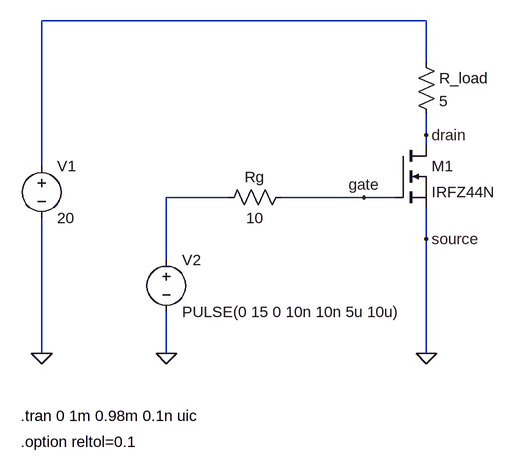
[diagram p0: schematic Switching MOSFET.asc]
Switching MOSFET.asc, the LTspice schematic file:
Version 4
SHEET 1 880 680
WIRE 544 -208 -48 -208
WIRE 544 -144 544 -208
WIRE 544 -32 544 -64
WIRE 544 -16 544 -32
WIRE -48 16 -48 -208
WIRE 240 64 144 64
WIRE 448 64 320 64
WIRE 496 64 448 64
WIRE 544 128 544 80
WIRE 144 160 144 64
WIRE -48 304 -48 96
WIRE 144 304 144 240
WIRE 544 304 544 128
FLAG 144 304 0
FLAG 544 304 0
FLAG -48 304 0
FLAG 544 -32 drain
FLAG 448 64 gate
FLAG 544 128 source
SYMBOL voltage 144 144 R0
WINDOW 123 0 0 Left 0
WINDOW 39 0 0 Left 0
SYMATTR InstName V2
SYMATTR Value PULSE(0 15 0 10n 10n 5u 10u)
SYMBOL res 336 48 R90
WINDOW 0 0 56 VBottom 2
WINDOW 3 32 56 VTop 2
SYMATTR InstName Rg
SYMATTR Value 10
SYMBOL nmos 496 -16 R0
SYMATTR InstName M1
SYMATTR Value IRFZ44N
SYMBOL voltage -48 0 R0
WINDOW 123 0 0 Left 0
WINDOW 39 0 0 Left 0
SYMATTR InstName V1
SYMATTR Value 20
SYMBOL res 528 -160 R0
SYMATTR InstName R_load
SYMATTR Value 5
TEXT -80 400 Left 2 !.tran 0 1m 0.98m 0.1n uic
TEXT -80 440 Left 2 !.option reltol=0.1

The netlist it stands for:
* Switching MOSFET.asc
V2 N002 0 PULSE(0 15 0 10n 10n 5u 10u)
Rg gate N002 10
M1 drain gate 0 0 IRFZ44N
V1 N001 0 20
R_load N001 drain 5
.model NMOS NMOS
.model PMOS PMOS
.lib standard.mos
.tran 0 1m 0.98m 0.1n uic
.option reltol=0.1
.backanno
.end